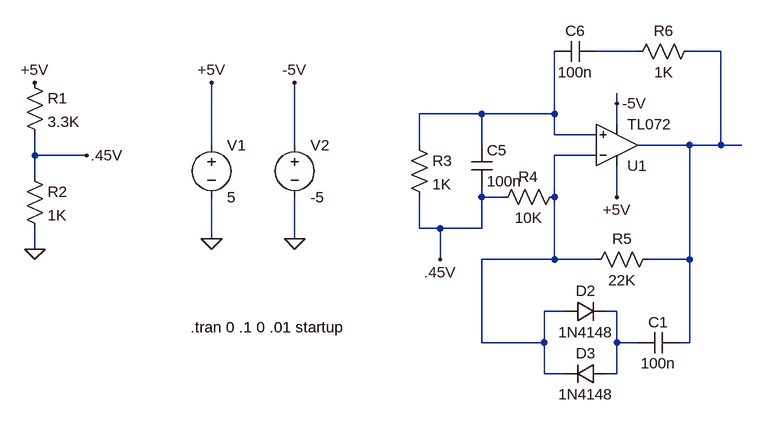
[diagram p0: schematic miniEC_WienBridgeWithFG_V1.asc]
miniEC_WienBridgeWithFG_V1.asc, the LTspice schematic file:
Version 4
SHEET 1 1632 680
WIRE 176 -16 112 -16
WIRE 304 -16 256 -16
WIRE 144 64 144 48
WIRE -64 80 -160 80
WIRE 48 80 48 -16
WIRE 48 80 -64 80
WIRE 144 96 144 64
WIRE 48 112 48 80
WIRE 112 112 48 112
WIRE -480 128 -480 32
WIRE -352 128 -352 32
WIRE -160 128 -160 80
WIRE -64 128 -64 80
WIRE 256 128 176 128
WIRE 304 128 304 -16
WIRE 304 128 256 128
WIRE 336 128 304 128
WIRE -752 144 -752 112
WIRE -672 144 -752 144
WIRE 112 144 48 144
WIRE -752 176 -752 144
WIRE -64 208 -64 192
WIRE -32 208 -64 208
WIRE 48 208 48 144
WIRE 144 208 144 160
WIRE -160 256 -160 208
WIRE -128 256 -160 256
WIRE -64 256 -64 208
WIRE -64 256 -128 256
WIRE -480 272 -480 208
WIRE -352 272 -352 208
WIRE -752 288 -752 256
WIRE -128 304 -128 256
WIRE 48 304 48 208
WIRE 48 304 -64 304
WIRE 112 304 48 304
WIRE 256 304 256 128
WIRE 256 304 192 304
WIRE 64 384 32 384
WIRE 144 384 128 384
WIRE -64 432 -64 304
WIRE 32 432 32 384
WIRE 32 432 -64 432
WIRE 144 432 144 384
WIRE 176 432 144 432
WIRE 256 432 256 304
WIRE 256 432 240 432
WIRE 32 480 32 432
WIRE 64 480 32 480
WIRE 144 480 144 432
WIRE 144 480 128 480
FLAG 144 64 -5V
FLAG 144 208 +5V
FLAG -480 272 0
FLAG -352 272 0
FLAG -480 32 +5V
FLAG -352 32 -5V
FLAG -752 288 0
FLAG -752 32 +5V
FLAG -672 144 .45V
FLAG -128 304 .45V
SYMBOL res -176 112 R0
SYMATTR InstName R3
SYMATTR Value 1K
SYMBOL res 272 -32 R90
WINDOW 0 0 56 VBottom 2
WINDOW 3 32 56 VTop 2
SYMATTR InstName R6
SYMATTR Value 1K
SYMBOL res 64 192 R90
WINDOW 0 0 56 VBottom 2
WINDOW 3 32 56 VTop 2
SYMATTR InstName R4
SYMATTR Value 10K
SYMBOL res 208 288 R90
WINDOW 0 0 56 VBottom 2
WINDOW 3 32 56 VTop 2
SYMATTR InstName R5
SYMATTR Value 22K
SYMBOL cap -80 128 R0
SYMATTR InstName C5
SYMATTR Value 100n
SYMBOL cap 112 -32 R90
WINDOW 0 0 32 VBottom 2
WINDOW 3 32 32 VTop 2
SYMATTR InstName C6
SYMATTR Value 100n
SYMBOL voltage -480 112 R0
WINDOW 123 0 0 Left 2
WINDOW 39 0 0 Left 2
SYMATTR InstName V1
SYMATTR Value 5
SYMBOL voltage -352 112 R0
WINDOW 123 0 0 Left 2
WINDOW 39 0 0 Left 2
SYMATTR InstName V2
SYMATTR Value -5
SYMBOL cap 240 416 R90
WINDOW 0 0 32 VBottom 2
WINDOW 3 32 32 VTop 2
SYMATTR InstName C1
SYMATTR Value 100n
SYMBOL diode 64 400 R270
WINDOW 0 32 32 VTop 2
WINDOW 3 0 32 VBottom 2
SYMATTR InstName D2
SYMATTR Value 1N4148
SYMBOL diode 128 496 M270
WINDOW 0 32 32 VTop 2
WINDOW 3 0 32 VBottom 2
SYMATTR InstName D3
SYMATTR Value 1N4148
SYMBOL TL072 144 192 M180
SYMATTR InstName U1
SYMBOL res -768 16 R0
SYMATTR InstName R1
SYMATTR Value 3.3K
SYMBOL res -768 160 R0
SYMATTR InstName R2
SYMATTR Value 1K
TEXT -512 408 Left 2 !.tran 0 .1 0 .01 startup

The netlist it stands for:
* miniEC_WienBridgeWithFG_V1.asc
R3 N003 .45V 1K
R6 N002 N001 1K
R4 N004 .45V 10K
R5 N002 N004 22K
C5 N003 .45V 100n
C6 N001 N003 100n
V1 +5V 0 5
V2 -5V 0 -5
C1 N002 N005 100n
D2 N004 N005 1N4148
D3 N005 N004 1N4148
* U1: TL072 (symbol TL072 not available, pins judged from their places): In+=N003 In-=N004 V+=+5V V-=-5V OUT=N002
R1 +5V .45V 3.3K
R2 .45V 0 1K
.model D D
.lib standard.dio
.tran 0 .1 0 .01 startup
.backanno
.end